# Altium schematic sheet Sheet1.SchDoc
size A4
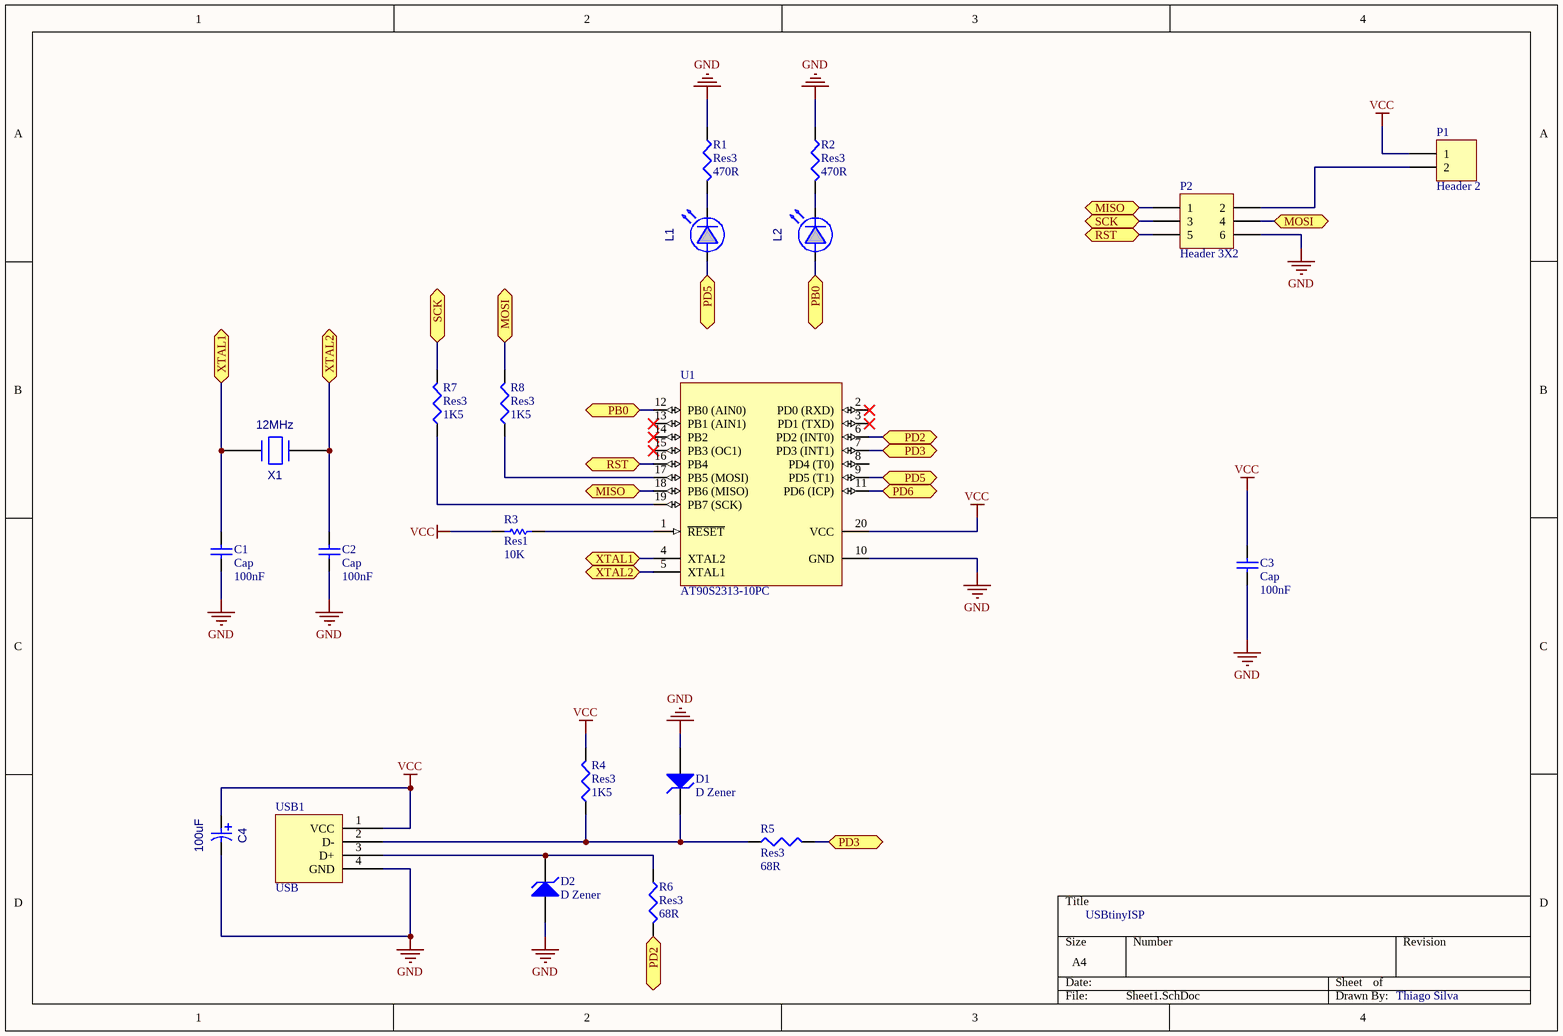
[diagram p0: Sheet1.SchDoc]

## Parts
C1  Cap  value 100nF  [CAP CER 100nF (25V) - UP]
C2  Cap  value 100nF  [CAP CER 100nF (25V) - UP]
C3  Cap  value 100nF  [CAP CER 100nF (25V) - UP]
C4  value 100uF  [CAP100RP]  (hidden comment: CAP100RP-SC)
D1  D Zener  [DIODE ZENER]
D2  D Zener  [DIODE ZENER]
L1  LED3MM  [LED3MM]  (value not drawn)
L2  LED3MM  [LED3MM]  (value not drawn)
P1  Header 2  [HEADER1X2]
P2  Header 3X2  [ISP]
R1  Res3  value 470R  [AXIAL-0.4 - DOWN]
R2  Res3  value 470R  [AXIAL-0.4 - DOWN]
R3  Res1  value 10K  [AXIAL-0.4 - DOWN]
R4  Res3  value 1K5  [AXIAL-0.4 - DOWN]
R5  Res3  value 68R  [AXIAL-0.4 - DOWN]
R6  Res3  value 68R  [AXIAL-0.4 - DOWN]
R7  Res3  value 1K5  [AXIAL-0.4 - DOWN]
R8  Res3  value 1K5  [AXIAL-0.4 - DOWN]
U1  AT90S2313-10PC  [DIP-20P]
USB1  USB  [USB2.5-2H4D]
X1  value 12MHz  [CRISTAL]  (hidden comment: CRISTAL)

## Ports
MISO (bidir), MOSI (bidir), PB0 (bidir), PD2 (bidir), PD3 (bidir), PD5 (bidir), PD6 (bidir), RST (bidir), SCK (bidir), XTAL1 (bidir), XTAL2 (bidir)

## Nets
GND: C1.1 C2.1 C3.1 C4.1 D1.1(A) D2.1(A) P2.6 R1.1 R2.1 U1.10(GND) USB1.4(GND)
VCC: C3.2 C4.2 P1.1 R3.2 R4.2 U1.20(VCC) USB1.1(VCC)
MISO: P2.1 U1.18(PB6_(MISO)) ; port MISO
MOSI: P2.4 R8.2 ; port MOSI
PB0: L2.1 U1.12(PB0_(AIN0)) ; port PB0
PD2: R6.2 U1.6(PD2_(INT0)) ; port PD2
PD3: R5.2 U1.7(PD3_(INT1)) ; port PD3
PD5: L1.1 U1.9(PD5_(T1)) ; port PD5
PD6: U1.11(PD6_(ICP)) ; port PD6
RST: P2.5 U1.16(PB4) ; port RST
SCK: P2.3 R7.2 ; port SCK
XTAL1: C1.2 U1.4(XTAL2) X1.2 ; port XTAL1
XTAL2: C2.2 U1.5(XTAL1) X1.1 ; port XTAL2
NetD1_2: D1.2(K) R4.1 R5.1 USB1.2(D-)
NetD2_2: D2.2(K) R6.1 USB1.3(D+)
NetL1_2: L1.2 R1.2
NetL2_2: L2.2 R2.2
NetP1_2: P1.2 P2.2
NetR3_1: R3.1 U1.1(~{RESET})
NetR7_1: R7.1 U1.19(PB7_(SCK))
NetR8_1: R8.1 U1.17(PB5_(MOSI))

Not connected (* = marked no-connect by the designer): U1 2(PD0_(RXD))* 3(PD1_(TXD))* 8(PD4_(T0)) 13(PB1_(AIN1))* 14(PB2)* 15(PB3_(OC1))*

## Notes on the sheet
- USBtinyISP
- Thiago Silva

## Library data of the parts
C1-C3 = Cap: Capacitor; Published: 8-Jun-2000; LatestRevisionDate: 17-Jul-2002; LatestRevisionNote: Re-released for DXP Platform.; PackageReference: RAD-0.3; Publisher: Altium Limited
D1 D2 = D Zener: Zener Diode; Published: 8-Jun-2000; LatestRevisionDate: 17-Jul-2002; LatestRevisionNote: Re-released for DXP Platform.; PackageReference: DIODE-0.7; Publisher: Altium Limited
P1 = Header 2: Header, 2-Pin; LatestRevisionDate: 17-Jul-2002; LatestRevisionNote: Re-released for DXP Platform.; Publisher: Altium Limited
P2 = Header 3X2: Header, 3-Pin, Dual row; LatestRevisionDate: 17-Jul-2002; LatestRevisionNote: Re-released for DXP Platform.; Publisher: Altium Limited
R1 R2 R4-R8 = Res3: Resistor; Published: 8-Jun-2000; LatestRevisionDate: 29-May-2009; LatestRevisionNote: IPC-7351 Footprint Added.; PackageReference: J1-0603; Publisher: Altium Limited; PackageDescription: Chip Resistor
R3 = Res1: Resistor; Published: 8-Jun-2000; LatestRevisionDate: 17-Jul-2002; LatestRevisionNote: Re-released for DXP Platform.; PackageReference: AXIAL-0.3; Publisher: Altium Limited
U1 = AT90S2313-10PC: 8-Bit AVR Microcontroller with 2K Bytes of In-System Programmable Flash Memory; Published: 17-Sep-2003; LatestRevisionDate: 04-Mar-2005; LatestRevisionNote: Stylized 3D Model Added.; DatasheetVersion: 0839I-AVR-06/02; PackageVersion: Aug-1999; PackageReference: 20P3; Publisher: Altium Limited; PackageDescription: DIP; 20 Leads; Row Spacing 7.62 mm; Pitch 2.54 mm; Code_JEDEC: MS-001-AD; ComponentLink1Description: Manufacturer Link; ComponentLink1URL: http://www.atmel.com; ComponentLink2Description: Datasheet; ComponentLink2URL: http://www.atmel.com/dyn/resources/prod_documents/doc0839.pdf